# EAGLE design RPI_board_191219 (EAGLE 9.5.1)
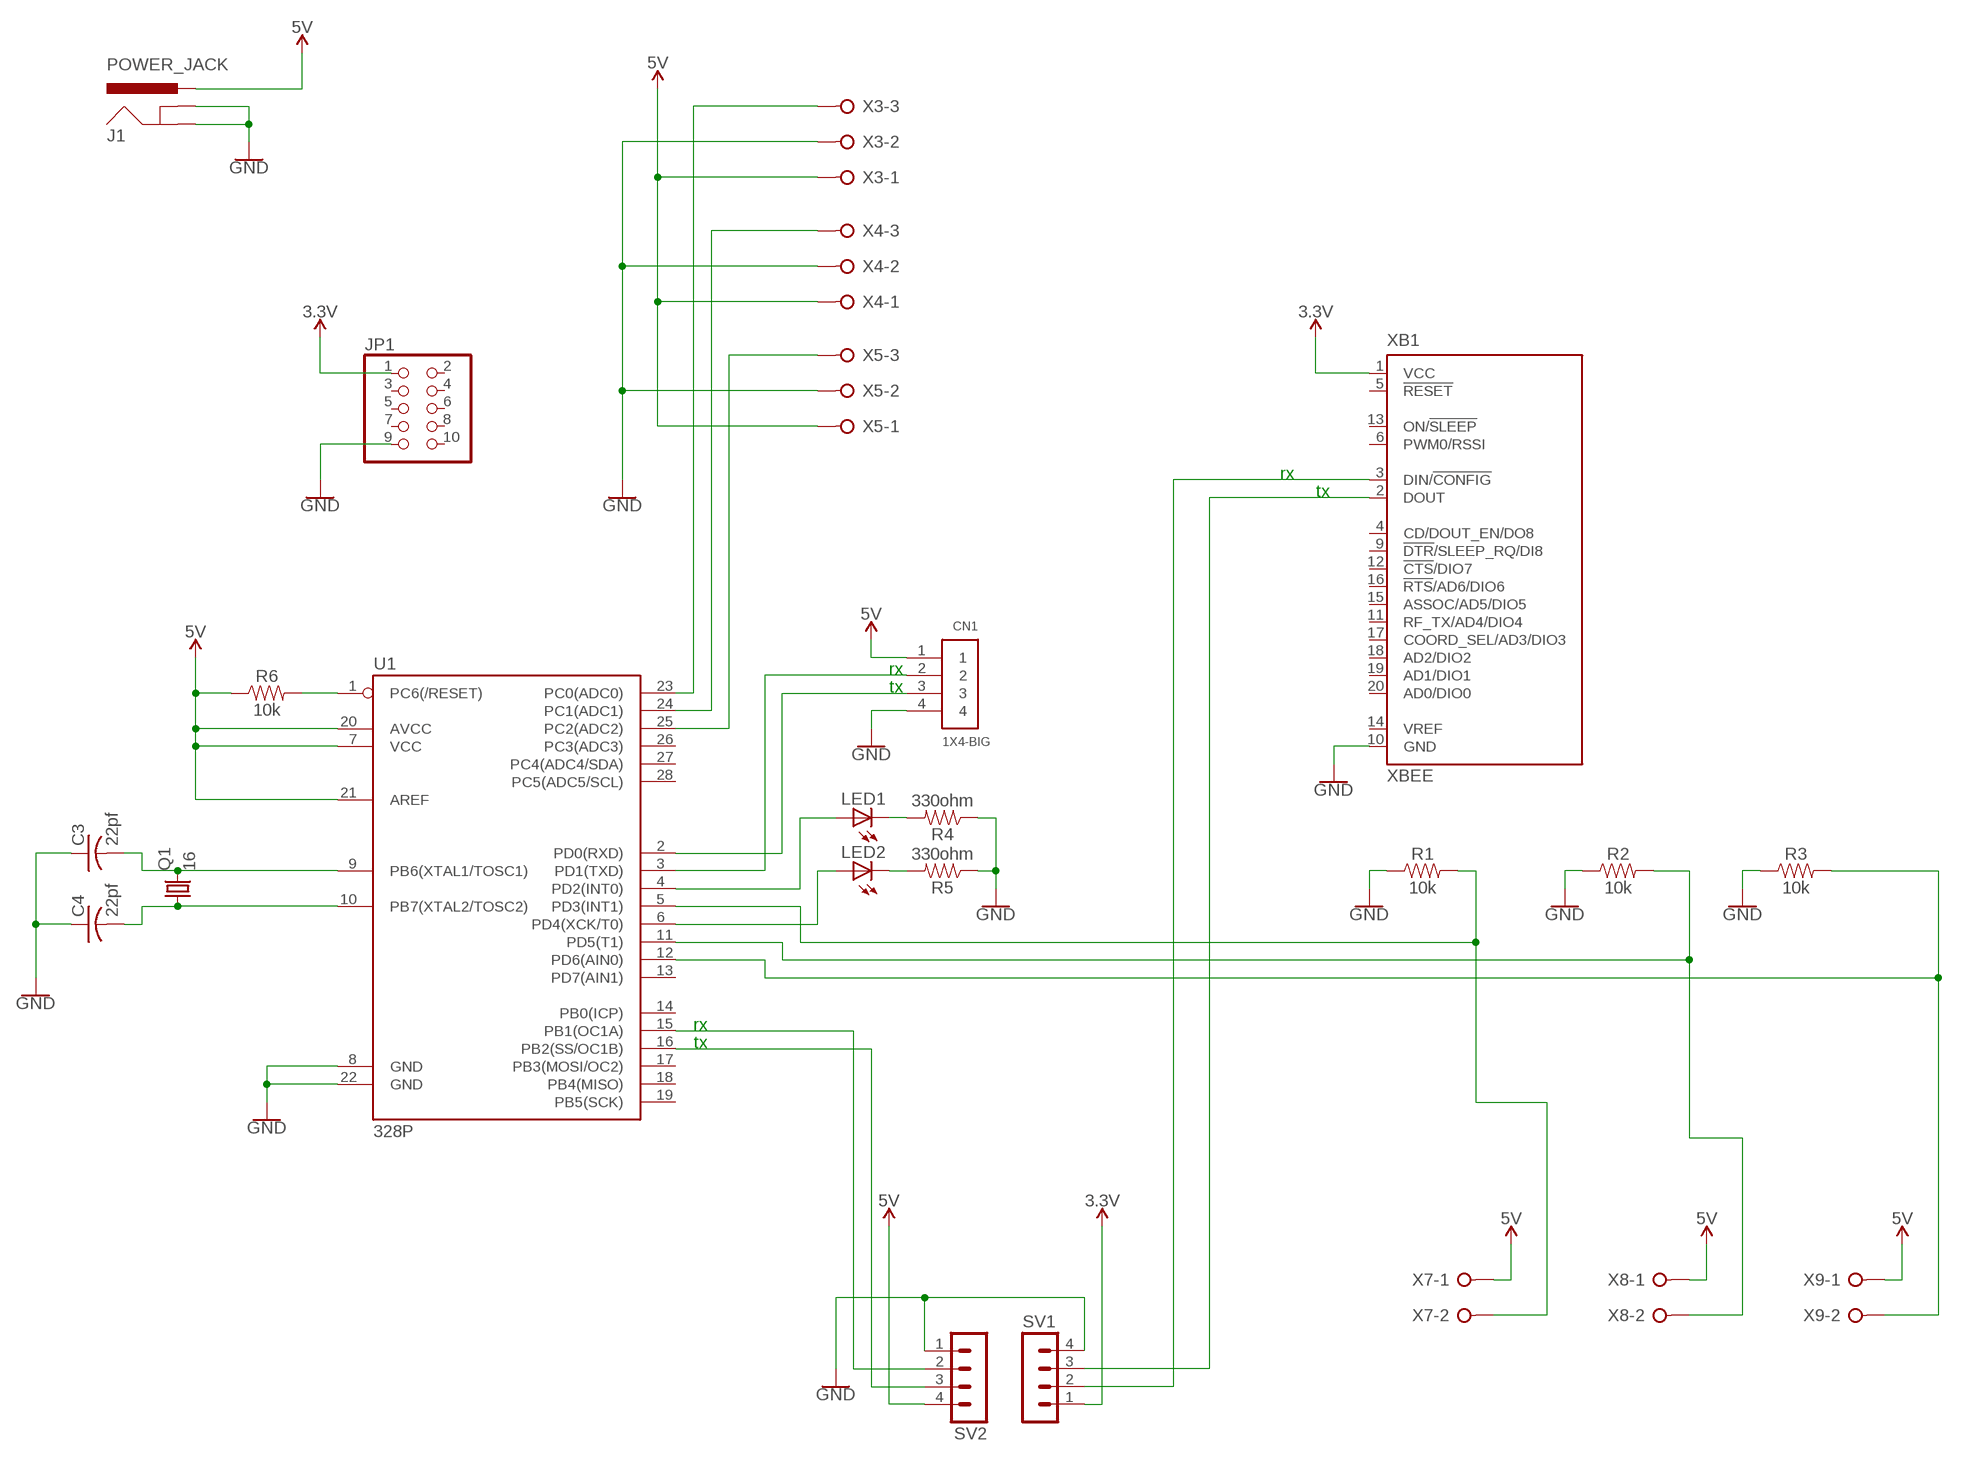
[diagram p0: schematic, sheet 1]

## Parts
C3  22pf  C-US050-025X075  [C050-025X075]
C4  22pf  C-US050-025X075  [C050-025X075]
CN1  1X4-BIG  [1X04-BIG]
J1  POWER_JACK  [POWER_JACK_PTH]
JP1  PINHD-2X5  [2X05]
LED1  LED3MM  [LED3MM]
LED2  LED3MM  [LED3MM]
Q1  16  CRYSTALHC49S  [HC49/S]
R1  10k  10KOHM-HORIZ-1/4W-5%  [AXIAL-0.3]
R2  10k  10KOHM-HORIZ-1/4W-5%  [AXIAL-0.3]
R3  10k  10KOHM-HORIZ-1/4W-5%  [AXIAL-0.3]
R4  330ohm  10KOHM-HORIZ-1/4W-5%  [AXIAL-0.3]
R5  330ohm  10KOHM-HORIZ-1/4W-5%  [AXIAL-0.3]
R6  10k  10KOHM-HORIZ-1/4W-5%  [AXIAL-0.3]
SV1  MA04-1  [MA04-1]
SV2  MA04-1  [MA04-1]
U1  328P  ATMEGA328P_PDIP  [DIP28]
X3  W237-3E  [W237-3E]
X4  W237-3E  [W237-3E]
X5  W237-3E  [W237-3E]
X7  W237-02P  [W237-132]
X8  W237-02P  [W237-132]
X9  W237-02P  [W237-132]
XB1  XBEE  [XBEE]

## Nets
3.3V: JP1.1 SV1.1 XB1.1(VCC)
5V: CN1.1 J1.PWR R6.P$1 SV2.4 U1.7(VCC) U1.20(AVCC) U1.21(AREF) X3.1 X4.1 X5.1 X7.1 X8.1 X9.1
GND: C3.1 C4.1 CN1.4 J1.GND J1.GNDBREAK JP1.9 R1.P$1 R2.P$1 R3.P$1 R4.P$1 R5.P$1 SV1.4 SV2.1 U1.8(GND) U1.22(GND) X3.2 X4.2 X5.2 XB1.10(GND)
N$3: CN1.3 U1.2(PD0(RXD))
N$4: CN1.2 U1.3(PD1(TXD))
N$5: U1.23(PC0(ADC0)) X3.3
N$6: U1.24(PC1(ADC1)) X4.3
N$7: U1.25(PC2(ADC2)) X5.3
N$8: LED1.A U1.4(PD2(INT0))
N$9: LED2.A U1.6(PD4(XCK/T0))
N$10: R1.P$2 U1.5(PD3(INT1)) X7.2
N$11: LED2.K(C) R5.P$2
N$12: LED1.K(C) R4.P$2
N$13: C3.2 Q1.2 U1.9(PB6(XTAL1/TOSC1))
N$14: C4.2 Q1.1 U1.10(PB7(XTAL2/TOSC2))
N$15: R6.P$2 U1.1(PC6(/RESET))
N$16: R3.P$2 U1.12(PD6(AIN0)) X9.2
N$17: R2.P$2 U1.11(PD5(T1)) X8.2
N$18: SV2.3 U1.16(PB2(SS/OC1B))
N$19: SV2.2 U1.15(PB1(OC1A))
N$20: SV1.2 XB1.3(DIN/!CONFIG)
N$21: SV1.3 XB1.2(DOUT)
Unconnected: JP1.2 JP1.3 JP1.4 JP1.5 JP1.6 JP1.7 JP1.8 JP1.10 U1.13(PD7(AIN1)) U1.14(PB0(ICP)) U1.17(PB3(MOSI/OC2)) U1.18(PB4(MISO)) U1.19(PB5(SCK)) U1.26(PC3(ADC3)) U1.27(PC4(ADC4/SDA)) U1.28(PC5(ADC5/SCL)) XB1.4(CD/DOUT_EN/DO8) XB1.5(!RESET) XB1.6(PWM0/RSSI) XB1.9(!DTR!/SLEEP_RQ/DI8) XB1.11(RF_TX/AD4/DIO4) XB1.12(!CTS!/DIO7) XB1.13(ON/!SLEEP) XB1.14(VREF) XB1.15(ASSOC/AD5/DIO5) XB1.16(!RTS!/AD6/DIO6) XB1.17(COORD_SEL/AD3/DIO3) XB1.18(AD2/DIO2) XB1.19(AD1/DIO1) XB1.20(AD0/DIO0)

## Notes on the sheet
- rx
- tx
- rx
- tx
- rx
- tx

## Library data of the parts
C3 C4 = adafruit:C-US: CAPACITOR, American symbol
CN1 = adafruit:1X4: 4-pin connector
J1 = SparkFun-Connectors:POWER_JACK: Power Jack Connector This is the standard 5.5mm barrel jack for power. The PTH is the most common, proven, reliable, footprint. The Slot footprint only works if the mill layer is transmitted to the PCB fab house so be warned. Here are the connectors we sell at SparkFun: DC Barrel Power Jack/Connector <https://www.sparkfun.com/products/119> (PRT-00119) DC Barrel Power Jack/Connector (SMD) <https://www.sparkfun.com/products/12748> (PRT-12748) DC Barrel Jack Adapter - Breadboard Compatible <https://www.sparkfun.com/products/10811> (PRT-10811) It is used on this SparkFun product (and many, many others): SparkFun RedBoard - Programmed with Arduino <https://www.sparkfun.com/products/12757> (DEV-12757) Also, if you need a mating power supply or connector, please check these out: Wall Adapter Power Supply - 9VDC 650mA <https://www.sparkfun.com/products/298> (TOL-00298) DC Barrel Jack Adapter - Male <https://www.sparkfun.com/products/10287> (PRT-10287); PROD_ID: CONN-08197
JP1 = pinhead:PINHD-2X5: PIN HEADER
LED1 LED2 = adafruit:LED: LED OSRAM: - CHIPLED LG R971, LG N971, LY N971, LG Q971, LY Q971, LO R971, LY R971 LH N974, LH R974 LS Q976, LO Q976, LY Q976 LO Q996 - Hyper CHIPLED LW Q18S LB Q993, LB Q99A, LB R99A - SideLED LS A670, LO A670, LY A670, LG A670, LP A670 LB A673, LV A673, LT A673, LW A673 LH A674 LY A675 LS A676, LA A676, LO A676, LY A676, LW A676 LS A679, LY A679, LG A679 - Hyper Micro SIDELED® LS Y876, LA Y876, LO Y876, LY Y876 LT Y87S - SmartLED LW L88C, LW L88S LB L89C, LB L89S, LG L890 LS L89K, LO L89K, LY L89K LS L896, LA L896, LO L896, LY L896 - TOPLED LS T670, LO T670, LY T670, LG T670, LP T670 LSG T670, LSP T670, LSY T670, LOP T670, LYG T670 LG T671, LOG T671, LSG T671 LB T673, LV T673, LT T673, LW T673 LH T674 LS T676, LA T676, LO T676, LY T676, LB T676, LH T676, LSB T676, LW T676 LB T67C, LV T67C, LT T67C, LS T67K, LO T67K, LY T67K, LW E67C LS E67B, LA E67B, LO E67B, LY E67B, LB E67C, LV E67C, LT E67C LW T67C LS T679, LY T679, LG T679 LS T770, LO T770, LY T770, LG T770, LP T770 LB T773, LV T773, LT T773, LW T773 LH T774 LS E675, LA E675, LY E675, LS T675 LS T776, LA T776, LO T776, LY T776, LB T776 LHGB T686 LT T68C, LB T68C - Hyper Mini TOPLED® LB M676 - Mini TOPLED Santana® LG M470 LS M47K, LO M47K, LY M47K Source: http://www.osram.convergy.de/
Q1 = adafruit:CRYSTAL: CRYSTAL; OC_FARNELL: 1667008; OC_NEWARK: unknown
R1-R3 R6 = SparkFun-Resistors:10KOHM: 10kΩ resistor A resistor is a passive two-terminal electrical component that implements electrical resistance as a circuit element. Resistors act to reduce current flow, and, at the same time, act to lower voltage levels within circuits. - Wikipedia; PROD_ID: RES-09435
R4 R5 = SparkFun-Resistors:10KOHM: 10kΩ resistor A resistor is a passive two-terminal electrical component that implements electrical resistance as a circuit element. Resistors act to reduce current flow, and, at the same time, act to lower voltage levels within circuits. - Wikipedia; PROD_ID: RES-09435; VALUE: 10k
SV1 SV2 = con-lstb:MA04-1: PIN HEADER; OC_FARNELL: unknown; OC_NEWARK: unknown
U1 = SparkFun-IC-Microcontroller:ATMEGA328P_PDIP: Atmel 328P Through hole ATMEGA328P uC used in the Arduino 32kb flash, 1k EEPROM, 2k SRAM Datasheet <http://www.sparkfun.com/datasheets/Components/SMD/ATMega328.pdf> SparkFun Products Storefront component: AVR 28 Pin 20MHz 32K 6A/D - ATMega328P <https://www.sparkfun.com/products/9061> (COM-09061) SparkFun Simon Says - Through-Hole Soldering Kit <https://www.sparkfun.com/products/10547> (KIT-10547) SparkFun Learn to Solder - Simon Says <https://www.sparkfun.com/products/13708> (KIT-13708) SparkFun BigTime Watch Kit <https://www.sparkfun.com/products/11734> (KIT-11734) SparkFun ClockIt <https://www.sparkfun.com/products/10930> (KIT-10930) SparkFun Serial Enabled LCD Kit <https://www.sparkfun.com/products/10097> (LCD-10097) SparkFun Simon Tilts - Through Hole Soldering Kit <https://www.sparkfun.com/products/12634> (KIT-12634) SparkFun Frequency Counter Kit <https://www.sparkfun.com/products/10140> (KIT-10140) FabFM Radio Kit <https://www.sparkfun.com/products/11043> (KIT-11043) SparkFun Binary Blaster Kit <https://www.sparkfun.com/products/12037> (KIT-12037) SparkFun Metro-Gnome <https://www.sparkfun.com/products/9236> (KIT-09236) ATmega328 with Arduino Optiboot (Uno) <https://www.sparkfun.com/products/10524> (DEV-10524); PROD_ID: IC-09136
X3-X5 = con-wago-508:W237-3E: WAGO SREW CLAMP; OC_FARNELL: unknown; OC_NEWARK: unknown
X7-X9 = con-wago-508:W237-02P: WAGO SREW CLAMP; OC_FARNELL: unknown; OC_NEWARK: unknown
XB1 = maxstream:XBEE: XBee (TM) /XBee-PRO(TM) OEM RF Modules Source: MaxStream, Inc. xbee_productmanual.pdf; MPN: XBP24-Z7UIT-004; OC_FARNELL: 1751799; OC_NEWARK: 34R5507

## Board
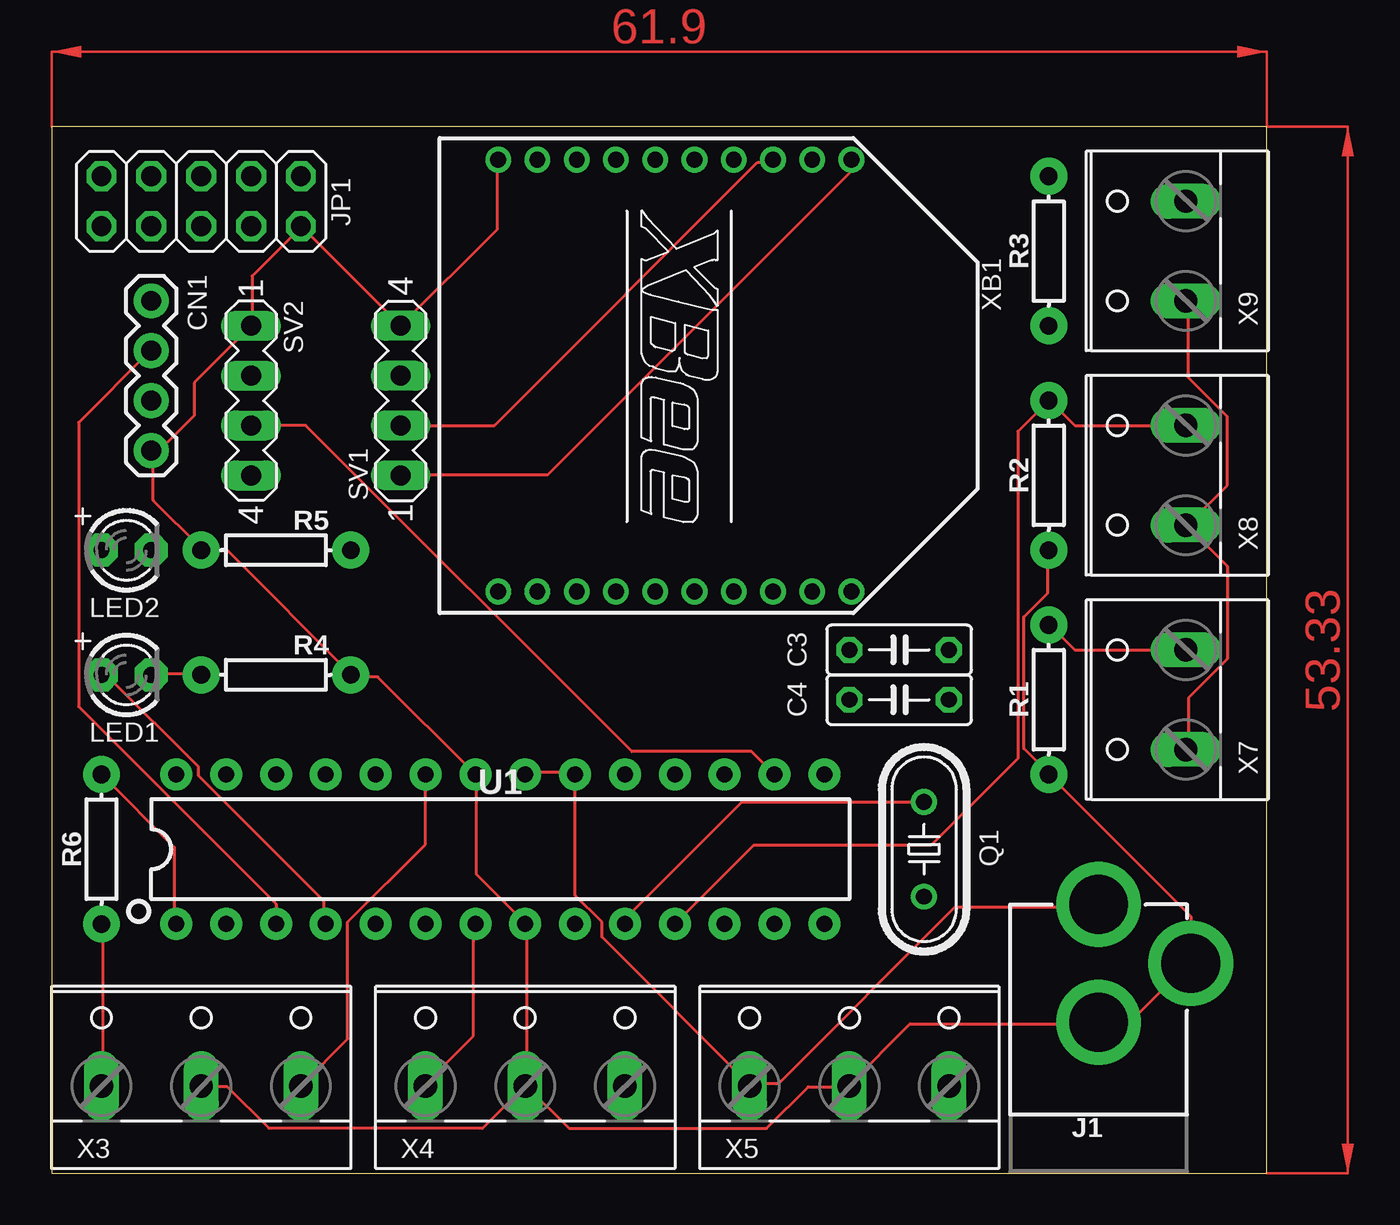
[diagram p1: board, top side]
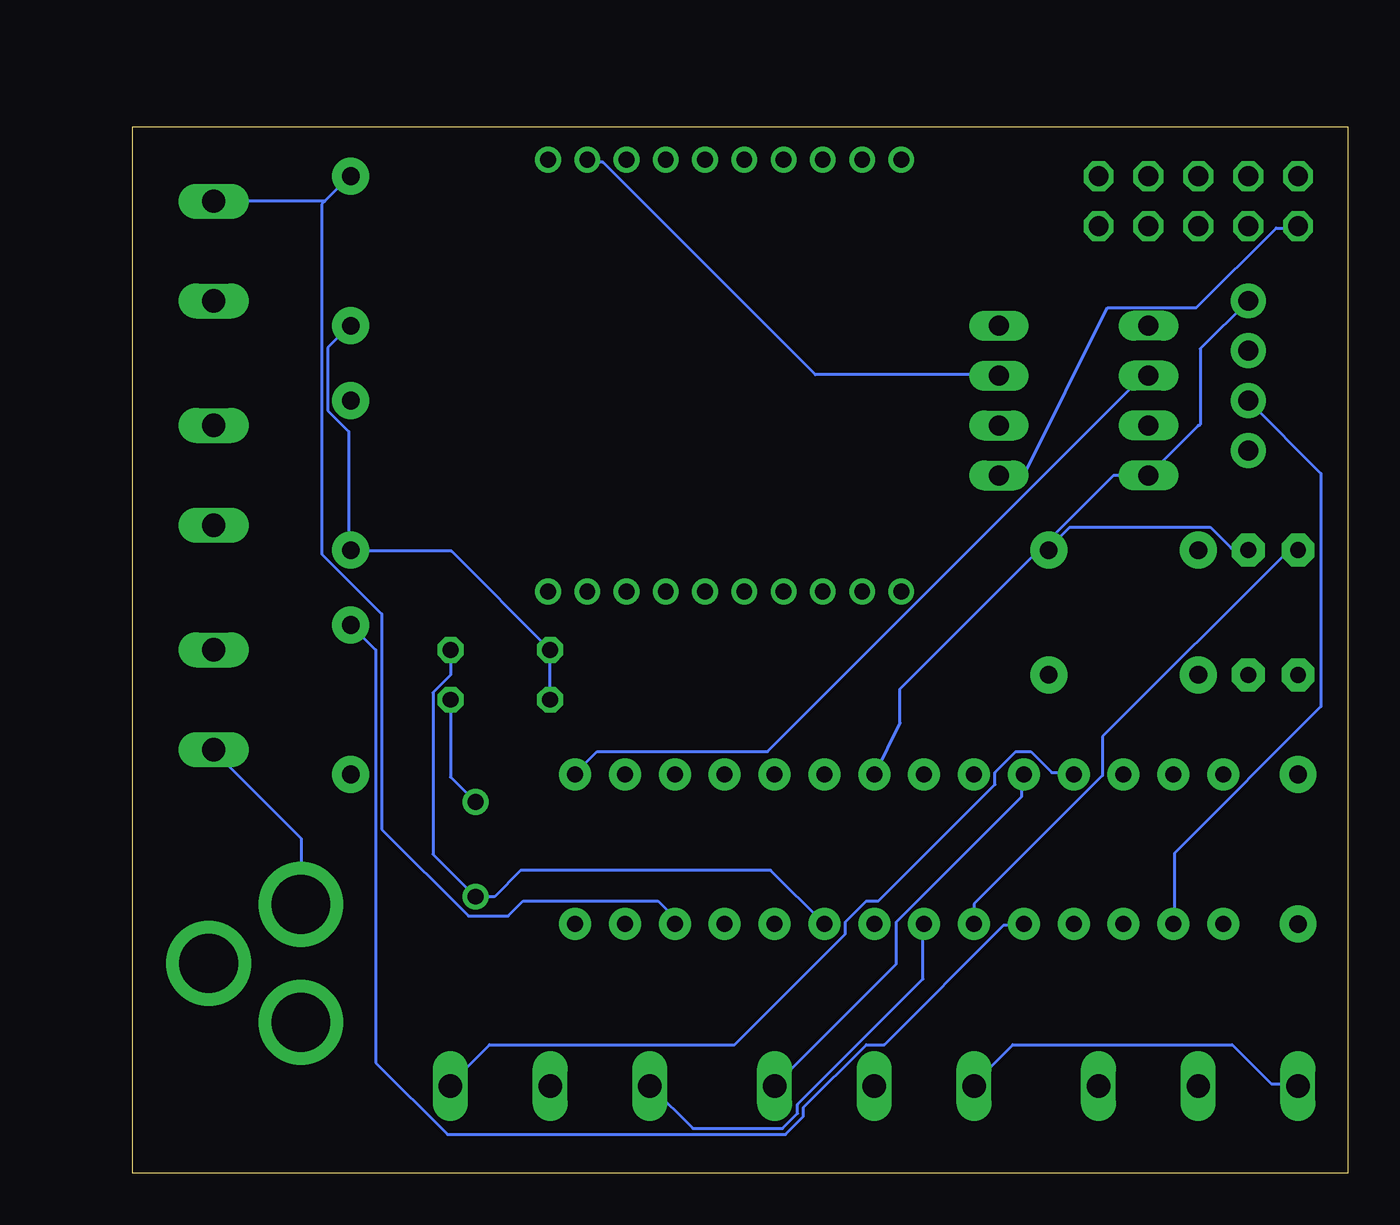
[diagram p2: board, bottom side, seen from below]

Size 61.9 x 53.33 mm. Coordinates in mm from the lower left corner, seen from the top.
Outline: 0,0 61.9,0 61.9,53.33 0,53.33 0,0
Copper layers (1*16): Top 0.035mm / dielectric 1.5mm / Bottom 0.035mm
Design rules "default": minimum track width 6mil, minimum drill 0.35mm, track to track 6mil, track to pad 6mil, pad to pad 6mil, via to via 6mil, smd to smd 6mil, copper to edge 40mil, drill to drill 6mil, minimum pad ring 10mil, minimum via ring 8mil, stop-mask expansion 4mil, vias tented up to drill 0mil, thermal gap 10mil

### Footprints (pad centres in the part's own frame; a part is rotated, then mirrored left to right if it is on the bottom)
C050-025X075 = drill 0.813 octagon: 1 -2.54,0; 2 2.54,0
1X04-BIG = drill 1.016 pad 1.778: 1 0,0; 2 2.54,0; 3 5.08,0; 4 7.62,0
POWER_JACK_PTH = drill 2.997 pad 4.318: GND 0,7.7; GNDBREAK 4.7,10.7; PWR 0,13.7
2X05 = drill 1.016 octagon: 1 -5.08,-1.27; 2 -5.08,1.27; 3 -2.54,-1.27; 4 -2.54,1.27; 5 0,-1.27; 6 0,1.27; 7 2.54,-1.27; 8 2.54,1.27; 9 5.08,-1.27; 10 5.08,1.27
LED3MM = drill 0.813 pad 1.676 octagon: A -1.27,0; K 1.27,0
HC49/S = drill 0.813: 1 -2.413,0; 2 2.413,0
AXIAL-0.3 = drill 0.9 pad 1.88: P$1 -3.81,0; P$2 3.81,0
MA04-1 = drill 1.016 long: 1 -3.81,0; 2 -1.27,0; 3 1.27,0; 4 3.81,0
DIP28 = drill 0.813 pad 1.626: 1 -16.51,-3.81; 2 -13.97,-3.81; 3 -11.43,-3.81; 4 -8.89,-3.81; 5 -6.35,-3.81; 6 -3.81,-3.81; 7 -1.27,-3.81; 8 1.27,-3.81; 9 3.81,-3.81; 10 6.35,-3.81; 11 8.89,-3.81; 12 11.43,-3.81; 13 13.97,-3.81; 14 16.51,-3.81; 15 16.51,3.81; 16 13.97,3.81; 17 11.43,3.81; 18 8.89,3.81; 19 6.35,3.81; 20 3.81,3.81; 21 1.27,3.81; 22 -1.27,3.81; 23 -3.81,3.81; 24 -6.35,3.81; 25 -8.89,3.81; 26 -11.43,3.81; 27 -13.97,3.81; 28 -16.51,3.81
W237-3E = drill 1.194 long: 1 -5.08,-0.635; 2 0,-0.635; 3 5.08,-0.635
W237-132 = drill 1.194 long: 1 -2.54,-0.635; 2 2.54,-0.635
XBEE = drill 0.8 pad 1.27: 1 -11,9; 2 -11,7; 3 -11,5; 4 -11,3; 5 -11,1; 6 -11,-1; 7 -11,-3; 8 -11,-5; 9 -11,-7; 10 -11,-9; 11 11,-9; 12 11,-7; 13 11,-5; 14 11,-3; 15 11,-1; 16 11,1; 17 11,3; 18 11,5; 19 11,7; 20 11,9

### Placement (x,y rotation side)
C3  43.18,26.67 0 top
C4  43.18,24.13 0 top
CN1  5.08,44.45 270 top
J1  53.34,0 0 top
JP1  7.62,49.53 0 top
LED1  3.81,25.4 0 top
LED2  3.81,31.75 0 top
Q1  44.45,16.51 270 top
R1  50.8,24.13 90 top
R2  50.8,35.56 90 top
R3  50.8,46.99 90 top
R4  11.43,25.4 180 top
R5  11.43,31.75 0 top
R6  2.54,16.51 90 top
SV1  17.78,39.37 90 top
SV2  10.16,39.37 270 top
U1  22.86,16.51 0 top
X3  7.62,5.08 0 top
X4  24.13,5.08 0 top
X5  40.64,5.08 0 top
X7  57.15,24.13 90 top
X8  57.15,35.56 90 top
X9  57.15,46.99 90 top
XB1  31.75,40.64 270 top

### Tracks (layer width: path | path; a pad name or v marks a point on that pad's centre or on a via)
3.3V
  Top 0.152: XB1.1 40.75,51.06 25.3,35.61 17.83,35.61 SV1.1
  Bottom 0.152: JP1.1 2.59,48.16 3.66,48.16 7.72,44.09 12.24,44.09 16.51,35.56 SV1.1
5V
  Top 0.152: X3.1 2.59,4.57 2.59,12.65 R6.P$1 | U1.7 21.49,12.65 21.49,7.01 19.05,4.57 X4.1 | X9.1 57.91,44.35 57.91,40.54 59.89,38.56 59.89,35.05 57.91,33.07 X8.1 57.91,32.92 59.89,30.94 59.89,26.21 57.91,24.23 57.91,21.64 X7.1 57.76,21.49 | U1.21 24.23,20.42 26.67,20.42 U1.20 26.67,14.17 28.04,12.8 28.04,12.04 35.51,4.57 X5.1 35.66,4.57 37.03,4.57 46.02,13.56 53.34,13.56 J1.PWR
  Bottom 0.152: X3.1 2.59,4.57 3.91,4.57 5.89,6.55 17.07,6.55 19.05,4.57 X4.1 | CN1.1 7.52,42.01 7.52,38.15 7.62,38.1 SV2.4 11.94,35.56 22.81,24.69 22.81,22.96 U1.21 | U1.7 21.64,12.65 21.64,9.91 28.04,3.5 28.04,3.05 28.8,2.29 33.38,2.29 35.51,4.42 X5.1 | J1.PWR 53.34,17.07 57.76,21.49 X7.1
GND
  Top 0.152: 50.9,20.27 R1.P$1 | R2.P$1 50.75,31.7 50.75,29.57 49.53,28.35 49.53,21.64 50.75,20.42 R1.P$1 | XB1.10 22.71,51.51 22.71,48.11 SV1.4 JP1.9 12.65,48.16 10.21,45.72 10.21,43.23 SV2.1 7.26,40.28 7.26,38.61 5.89,37.24 CN1.4 5.18,36.73 5.18,34.29 7.62,31.85 R5.P$1 7.62,31.7 8.99,31.7 15.24,25.45 R4.P$1 15.24,25.3 16.61,25.3 U1.22 | 21.64,20.42 U1.22 | X4.2 24.23,4.57 24.23,12.65 U1.8 24.08,12.8 21.64,15.24 21.64,20.27 U1.22 | X3.2 7.62,4.42 8.94,4.42 11.07,2.29 21.95,2.29 24.08,4.42 X4.2 | X4.2 24.23,4.42 26.36,2.29 36.42,2.29 38.56,4.42 40.54,4.42 X5.2 40.69,4.57 43.74,7.62 53.34,7.62 J1.GND 53.34,7.77 55.02,7.77 57.91,10.67 J1.GNDBREAK 58.04,13.08 R1.P$1
  Bottom 0.152: R3.P$1 50.9,43.13 51.97,42.06 51.97,38.86 50.9,37.8 50.9,31.85 R2.P$1 50.75,31.7 45.67,31.7 C3.1 C4.1 | 50.9,20.27 R1.P$1
N$3
  Bottom 0.152: CN1.3 1.37,35.66 1.37,23.77 8.84,16.31 8.84,12.8 U1.2
N$4
  Top 0.152: U1.3 11.43,13.72 1.37,23.77 1.37,38.25 5.03,41.91 CN1.2
N$5
  Top 0.152: U1.23 19.05,16.76 15.09,12.8 15.09,6.86 12.8,4.57 X3.3
N$6
  Bottom 0.152: U1.24 16.61,20.27 16.61,19.2 23.01,12.8 23.01,10.67 29.11,4.57 X4.3
N$7
  Bottom 0.152: U1.25 14.02,20.42 15.09,20.42 16.15,21.49 16.92,21.49 17.98,20.42 17.98,19.81 23.93,13.87 24.54,13.87 25.6,12.8 25.6,12.19 31.24,6.55 43.74,6.55 45.72,4.57 X5.3
N$8
  Top 0.152: U1.4 13.87,12.8 13.87,13.87 7.47,20.27 7.47,20.73 2.9,25.3 2.59,25.3 LED1.A
N$9
  Bottom 0.152: U1.6 19.05,13.72 12.5,20.27 12.5,22.25 3.05,31.7 2.59,31.7 LED2.A
N$10
  Top 0.152: X7.2 52.12,26.67 50.9,27.89 R1.P$2
  Bottom 0.152: R1.P$2 49.53,26.67 49.53,5.64 45.87,1.98 28.65,1.98 27.74,2.9 27.74,3.35 24.54,6.55 23.62,6.55 17.53,12.65 16.61,12.65 U1.5
N$11
  Bottom 0.152: LED2.K 5.18,31.85 5.94,31.85 7.01,32.92 14.17,32.92 15.24,31.85 R5.P$2
N$12
  Top 0.152: LED1.K 5.18,25.45 7.62,25.45 R4.P$2
N$13
  Bottom 0.152: U1.9 29.41,15.44 42.14,15.44 43.48,14.1 Q1.2 46.61,16.26 46.61,24.5 45.72,25.39 C3.2
N$14
  Top 0.152: 44.5,19.05 Q1.1 44.35,18.9 35.15,18.9 29.21,12.95 U1.10
  Bottom 0.152: C4.2 45.72,20.19 Q1.1
N$15
  Top 0.152: R6.P$2 6.25,16.61 6.25,12.8 U1.1
N$16
  Bottom 0.152: U1.12 34.29,13.01 35.15,13.87 42.01,13.87 42.77,13.11 44.81,13.11 49.23,17.53 49.23,28.5 52.27,31.55 52.27,49.38 52.12,49.53 | 52.12,49.53 50.9,50.75 R3.P$2 | 52.12,49.53 X9.2
N$17
  Top 0.152: U1.11 35.76,16.71 44.81,16.71 49.23,21.13 49.23,37.8 R2.P$2 50.9,39.32 52.12,38.1 X8.2
N$18
  Top 0.152: SV2.3 12.95,38.1 29.57,21.49 35.66,21.49 U1.16
N$19
  Bottom 0.152: SV2.2 10.21,40.54 10.52,40.54 29.57,21.49 38.25,21.49 39.32,20.42 U1.15
N$20
  Top 0.152: SV1.2 22.55,38.1 35.97,51.51 36.73,51.51 XB1.3
N$21
  Bottom 0.152: XB1.2 38.71,51.51 37.95,51.51 27.13,40.69 17.83,40.69 SV1.3
(copper drawn outside any net)
  shapes: Top area x2